# EAGLE design Main_Board (EAGLE 7.7.0)
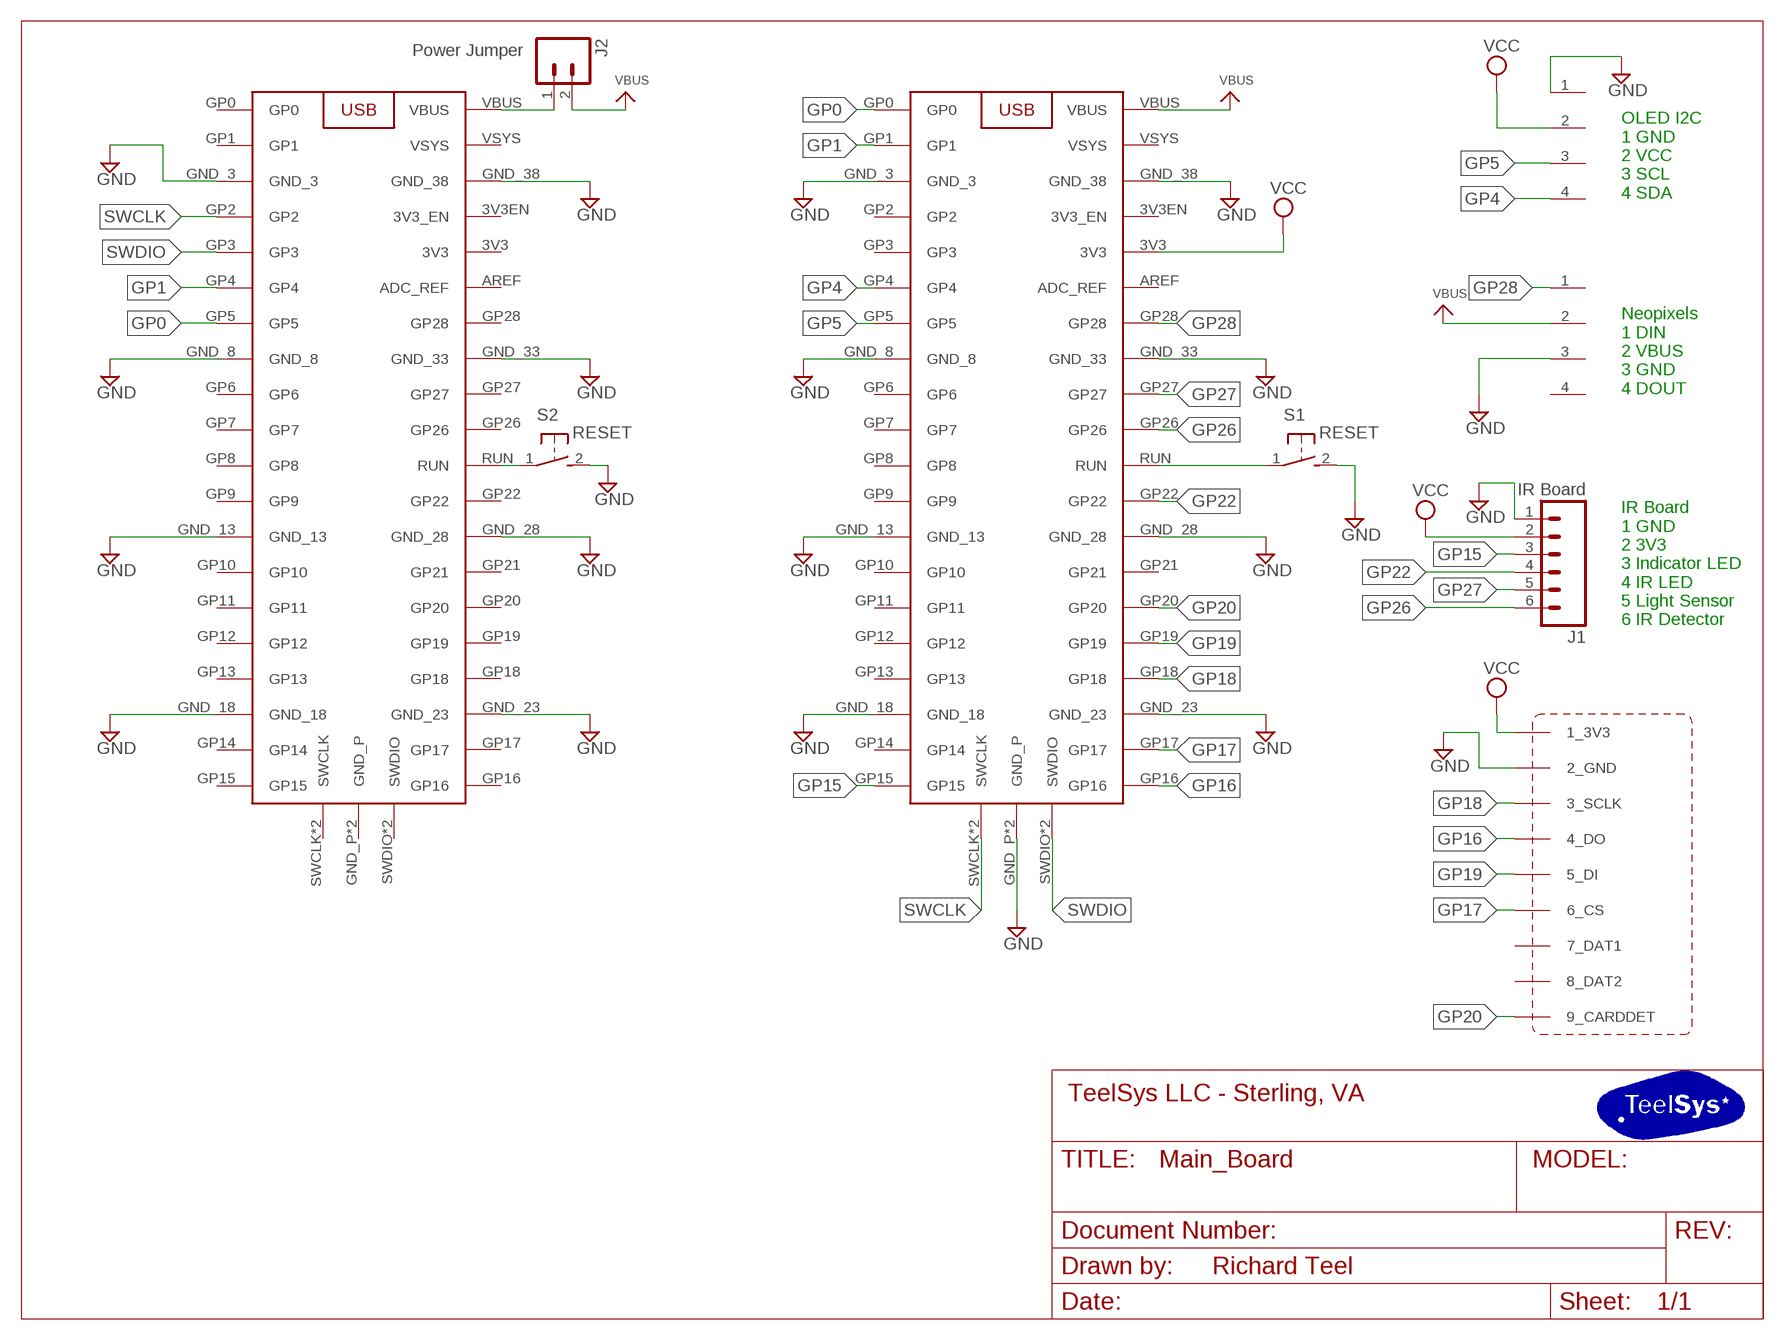
[diagram p0: schematic, sheet 1]
FRAME1 (LETTER_L): COMPANY_INFO: TeelSys LLC - Sterling, VA; DRAWN_BY: Richard Teel

## Parts
J1  IR Board  M06LONGPADS  [1X06_LONGPADS]
J2  Power Jumper  M02LOCK_LONGPADS  [1X02_LOCK_LONGPADS]
S1  RESET  ADAFRUIT_SW_1489THROUGH_HOLE  [ADAFRUIT_SW_1489]
S2  RESET  ADAFRUIT_SW_1489THROUGH_HOLE  [ADAFRUIT_SW_1489]
SDCARD2  ADAFRUIT_SDCARD3V3THROUGHHOLE  [ADAFRUIT_SDCARD3V3]
U$1  RASPBERRY_PI_PICORASPBERRY_PI_PICO_&_W  [RASPBERRY_PI_PICO_N_W]
U$2  RASPBERRY_PI_PICORASPBERRY_PI_PICO_&_W  [RASPBERRY_PI_PICO_N_W]
U$3  HEADER-1X4  [HEADER-1X4]
U$4  HEADER-1X4  [HEADER-1X4]

## Nets
GND: J1.1 S1.2(S) S2.2(S) SDCARD2.2_GND U$1.GND_3 U$1.GND_8 U$1.GND_13 U$1.GND_18 U$1.GND_23 U$1.GND_28 U$1.GND_33 U$1.GND_38 U$1.GND_P U$1.GND_P1(GND_P) U$2.GND_3 U$2.GND_8 U$2.GND_13 U$2.GND_18 U$2.GND_23 U$2.GND_28 U$2.GND_33 U$2.GND_38 U$3.3 U$4.1
GP0: U$1.GP0 U$2.GP5
GP1: U$1.GP1 U$2.GP4
GP4: U$1.GP4 U$4.4
GP5: U$1.GP5 U$4.3
GP15: J1.3 U$1.GP15
GP16: SDCARD2.4_DO U$1.GP16
GP17: SDCARD2.6_CS U$1.GP17
GP18: SDCARD2.3_SCLK U$1.GP18
GP19: SDCARD2.5_DI U$1.GP19
GP20: SDCARD2.9_CARDDET U$1.GP20
GP22: J1.4 U$1.GP22
GP26: J1.6 U$1.GP26
GP27: J1.5 U$1.GP27
GP28: U$1.GP28 U$3.1
N$1: S2.1(P) U$2.RUN
N$2: J2.1 U$2.VBUS
N$4: S1.1(P) U$1.RUN
SWCLK: U$1.SWCLK U$1.SWCLK1(SWCLK) U$2.GP2
SWDIO: U$1.SWDIO U$1.SWDIO1(SWDIO) U$2.GP3
VBUS: J2.2 U$1.VBUS U$3.2
VCC: J1.2 SDCARD2.1_3V3 U$1.3V3 U$4.2
Unconnected: SDCARD2.7_DAT1 SDCARD2.8_DAT2 U$1.3V3EN(3V3_EN) U$1.AREF(ADC_REF) U$1.GP2 U$1.GP3 U$1.GP6 U$1.GP7 U$1.GP8 U$1.GP9 U$1.GP10 U$1.GP11 U$1.GP12 U$1.GP13 U$1.GP14 U$1.GP21 U$1.VSYS U$2.3V3 U$2.3V3EN(3V3_EN) U$2.AREF(ADC_REF) U$2.GND_P U$2.GND_P1(GND_P) U$2.GP0 U$2.GP1 U$2.GP6 U$2.GP7 U$2.GP8 U$2.GP9 U$2.GP10 U$2.GP11 U$2.GP12 U$2.GP13 U$2.GP14 U$2.GP15 U$2.GP16 U$2.GP17 U$2.GP18 U$2.GP19 U$2.GP20 U$2.GP21 U$2.GP22 U$2.GP26 U$2.GP27 U$2.GP28 U$2.SWCLK U$2.SWCLK1(SWCLK) U$2.SWDIO U$2.SWDIO1(SWDIO) U$2.VSYS U$3.4

## Notes on the sheet
- OLED I2C
  1 GND
  2 VCC
  3 SCL
  4 SDA
- Neopixels
  1 DIN
  2 VBUS
  3 GND
  4 DOUT
- IR Board
  1 GND
  2 3V3
  3 Indicator LED
  4 IR LED
  5 Light Sensor
  6 IR Detector

## Library data of the parts
J1 = SparkFun-Connectors:M06: Header 6 Standard 6-pin 0.1" header. Use with straight break away headers (SKU : PRT-00116), right angle break away headers (PRT-00553), swiss pins (PRT-00743), machine pins (PRT-00117), and female headers (PRT-00115). Molex polarized connector foot print use with SKU : PRT-08094 with associated crimp pins and housings. NOTES ON THE VARIANTS LOCK and LOCK_LONGPADS... This footprint was designed to help hold the alignment of a through-hole component (i.e. 6-pin header) while soldering it into place. You may notice that each hole has been shifted either up or down by 0.005 of an inch from it's more standard position (which is a perfectly straight line). This slight alteration caused the pins (the squares in the middle) to touch the edges of the holes. Because they are alternating, it causes a "brace" to hold the component in place. 0.005 has proven to be the perfect amount of "off-center" position when using our standard breakaway headers. Although looks a little odd when you look at the bare footprint, once you have a header in there, the alteration is very hard to notice. Also,if you push a header all the way into place, it is covered up entirely on the bottom side. This idea of altering the position of holes to aid alignment will be further integrated into the Sparkfun Library for other footprints. It can help hold any component with 3 or more connection pins.
J2 = SparkFun-Connectors:M02: Standard 2-pin 0.1" header. Use with - straight break away headers ( PRT-00116) - right angle break away headers (PRT-00553) - swiss pins (PRT-00743) - machine pins (PRT-00117) - female headers (PRT-00115) Molex polarized connector foot print use with: PRT-08233 with associated crimp pins and housings. 2.54_SCREWTERM for use with PRT-10571. 3.5mm Screw Terminal footprints for PRT-08084 5mm Screw Terminal footprints for use with PRT-08432
S1 S2 = teelsys-0.2:ADAFRUIT_SW_1489: OMRON SWITCH
SDCARD2 = TeelSys-0.3:ADAFRUIT_SDCARD3V3: https://www.adafruit.com/product/4682; ADAFRUIT_PN: 4682
U$1 U$2 = teelsys-0.2:RASPBERRY_PI_PICO
U$3 U$4 = teelsys-0.2:HEADER-1X4

## Board
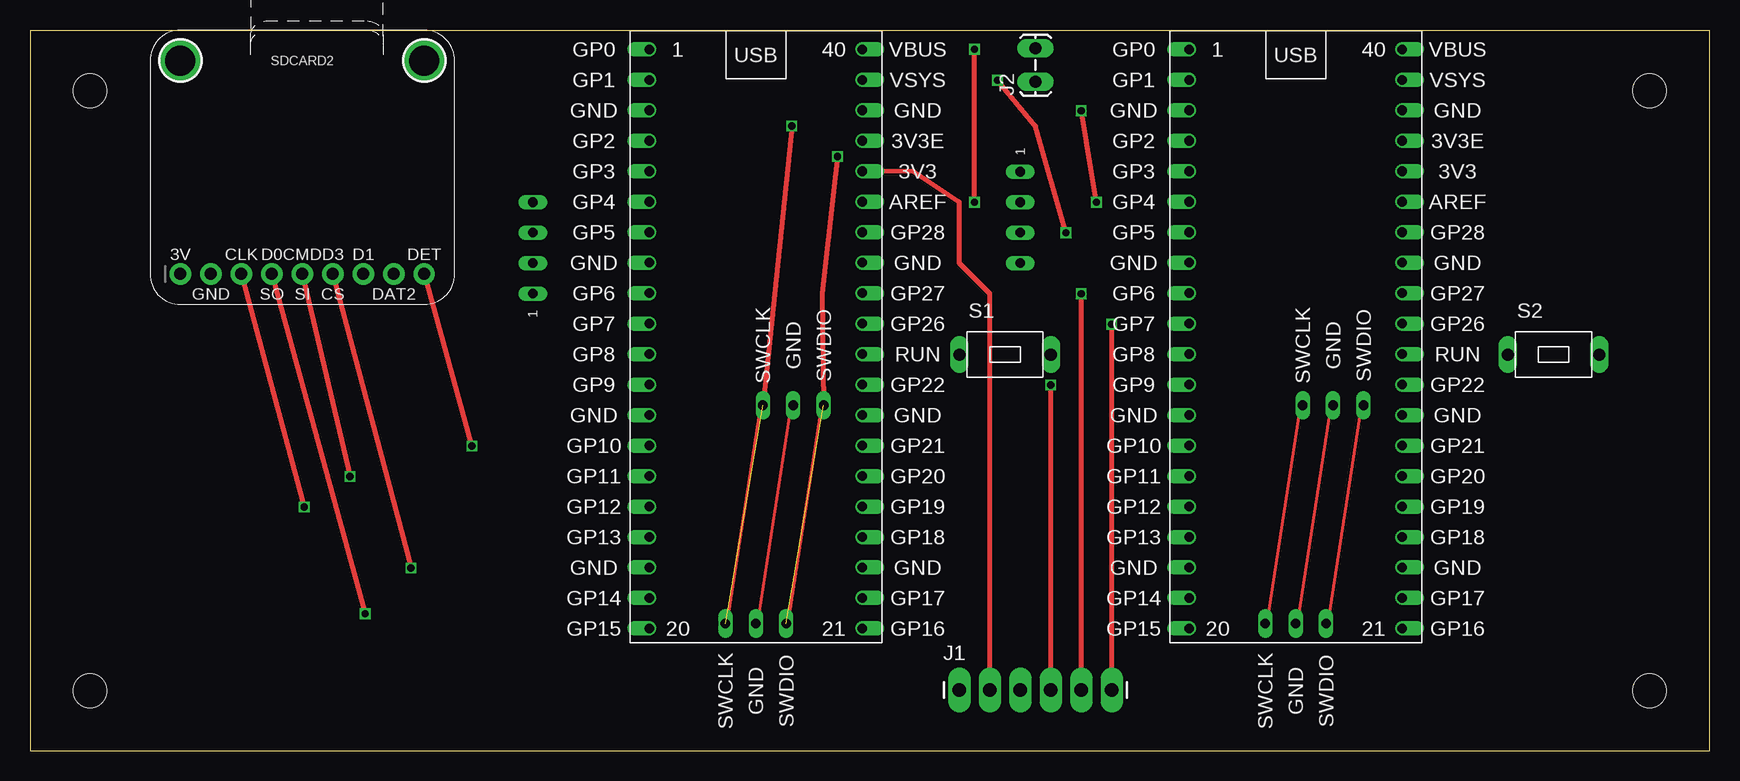
[diagram p1: board, top side]
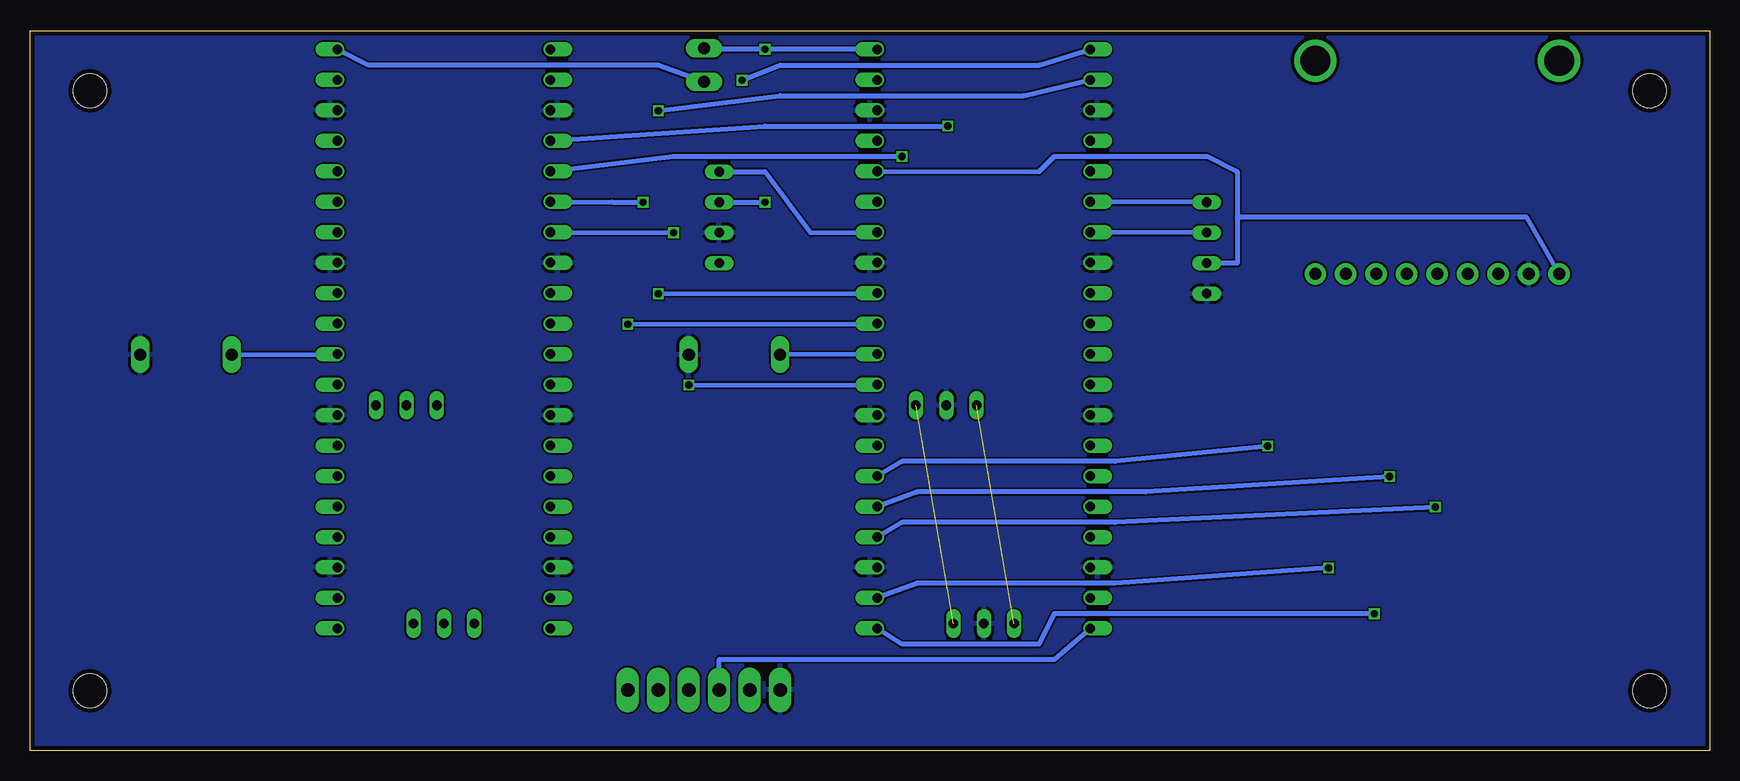
[diagram p2: board, bottom side, seen from below]

Size 140 x 60 mm. Coordinates in mm from the lower left corner, seen from the top.
Outline: 0,0 140,0 140,60 0,60 0,0
Copper layers (1*16): Top 0.035559375mm / dielectric 1.6mm / Bottom 0.035559375mm
Design rules "oshpark-2layer2020": minimum track width 6mil, minimum drill 10mil, track to track 6mil, track to pad 6mil, pad to pad 6mil, via to via 6mil, smd to smd 6mil, copper to edge 15mil, drill to drill 6mil, minimum pad ring 5mil, minimum via ring 5mil, stop-mask expansion 2.5mil, vias tented up to drill 0mil, thermal gap 10mil
Holes 2.8 mm at 5,5 5,55 135,5 135,55

### Footprints (pad centres in the part's own frame; a part is rotated, then mirrored left to right if it is on the bottom)
1X06_LONGPADS = drill 1.118 pad 1.88 long: 1 0,0; 2 2.54,0; 3 5.08,0; 4 7.62,0; 5 10.16,0; 6 12.7,0
1X02_LOCK_LONGPADS = drill 1.016 long: 1 -0.127,0; 2 2.667,0
ADAFRUIT_SW_1489 = drill 1.016 long: 1 -3.81,0; 2 3.81,0
ADAFRUIT_SDCARD3V3 = drill 1 pad 1.778: 1_3V3 2.54,2.54; 2_GND 5.08,2.54; 3_SCLK 7.62,2.54; 4_DO 10.16,2.54; 5_DI 12.7,2.54; 6_CS 15.24,2.54; 7_DAT1 17.78,2.54; 8_DAT2 20.32,2.54; 9_CARDDET 22.86,2.54 | drill 2.5 pad 3.2: P$1 22.86,20.32; P$2 2.54,20.32
RASPBERRY_PI_PICO_N_W = drill 0.8 offset: 3V3 19.39,39.3; 3V3EN 19.39,41.84; AREF 19.39,36.76; GND_3 1.61,44.38; GND_8 1.61,31.68; GND_13 1.61,18.98; GND_18 1.61,6.28; GND_23 19.39,6.28; GND_28 19.39,18.98; GND_33 19.39,31.68; GND_38 19.39,44.38; GP0 1.61,49.46; GP1 1.61,46.92; GP2 1.61,41.84; GP3 1.61,39.3; GP4 1.61,36.76; GP5 1.61,34.22; GP6 1.61,29.14; GP7 1.61,26.6; GP8 1.61,24.06; GP9 1.61,21.52; GP10 1.61,16.44; GP11 1.61,13.9; GP12 1.61,11.36; GP13 1.61,8.82; GP14 1.61,3.74; GP15 1.61,1.2; GP16 19.39,1.2; GP17 19.39,3.74; GP18 19.39,8.82; GP19 19.39,11.36; GP20 19.39,13.9; GP21 19.39,16.44; GP22 19.39,21.52; GP26 19.39,26.6; GP27 19.39,29.14; GP28 19.39,34.22; RUN 19.39,24.06; VBUS 19.39,49.46; VSYS 19.39,46.92 | drill 0.8 long: GND_P 13.624,19.8; GND_P1 10.5,1.6; SWCLK 11.084,19.8; SWCLK1 7.96,1.6; SWDIO 16.164,19.8; SWDIO1 13.04,1.6
HEADER-1X4 = drill 0.8 long: 1 0,3.81; 2 0,1.27; 3 0,-1.27; 4 0,-3.81

### Placement (x,y rotation side)
J1  77.47,5.08 0 top
J2  83.82,55.88 90 top
S1  81.28,33.02 0 top
S2  127,33.02 0 top
SDCARD2  10,37.2 0 top
U$1  50,9 0 top
U$2  95,9 0 top
U$3  82.55,44.45 0 top
U$4  41.91,41.91 180 top

### Tracks (layer width: path | path; a pad name or v marks a point on that pad's centre or on a via)
GND
  pour Bottom: 0,0 139.7,0 139.7,59.69 0,59.69
GP0  (via drill 0.6)
  Top 0.406: v86.36,43.18 83.82,52.07 v80.64,55.88
  Bottom 0.406: U$2.GP5 v86.36,43.18 | v80.64,55.88 77.47,57.15 55.88,57.15 U$1.GP0
GP1  (via drill 0.6)
  Top 0.406: v88.9,45.72 v87.63,53.34
  Bottom 0.406: U$2.GP4 91.44,45.72 v88.9,45.72 | v87.63,53.34 77.47,54.61 57.15,54.61 U$1.GP1
GP4
  Bottom 0.406: U$4.4 U$1.GP4
GP5
  Bottom 0.406: U$4.3 U$1.GP5
GP15
  Bottom 0.406: J1.3 82.55,7.62 54.61,7.62 U$1.GP15
GP16  (via drill 0.6)
  Top 0.406: SDCARD2.4_DO v27.94,11.43
  Bottom 0.406: v27.94,11.43 54.61,11.43 55.88,8.89 67.31,8.89 U$1.GP16
GP17  (via drill 0.6)
  Top 0.406: SDCARD2.6_CS v31.75,15.24
  Bottom 0.406: v31.75,15.24 49.53,13.97 66.04,13.97 U$1.GP17
GP18  (via drill 0.6)
  Top 0.406: SDCARD2.3_SCLK v22.86,20.32
  Bottom 0.406: v22.86,20.32 49.53,19.05 67.31,19.05 U$1.GP18
GP19  (via drill 0.6)
  Top 0.406: SDCARD2.5_DI v26.67,22.86
  Bottom 0.406: v26.67,22.86 46.99,21.59 66.04,21.59 U$1.GP19
GP20  (via drill 0.6)
  Top 0.406: SDCARD2.9_CARDDET v36.83,25.4
  Bottom 0.406: v36.83,25.4 49.53,24.13 67.31,24.13 U$1.GP20
GP22  (via drill 0.6)
  Top 0.406: J1.4 v85.09,30.48
  Bottom 0.406: v85.09,30.48 U$1.GP22
GP26  (via drill 0.6)
  Top 0.406: J1.6 v90.17,35.56
  Bottom 0.406: v90.17,35.56 U$1.GP26
GP27  (via drill 0.6)
  Top 0.406: J1.5 v87.63,38.1
  Bottom 0.406: v87.63,38.1 U$1.GP27
GP28
  Bottom 0.406: U$3.1 78.74,48.26 74.93,43.18 U$1.GP28
N$1
  Bottom 0.406: S2.1 U$2.RUN
N$2
  Bottom 0.406: J2.1 87.63,57.15 111.76,57.15 U$2.VBUS
N$4
  Bottom 0.406: U$1.RUN S1.1
SWCLK  (via drill 0.6)  (1 unrouted)
  Top 0.406: v63.5,52.07 U$1.SWCLK
  Bottom 0.406: U$2.GP2 78.74,52.07 v63.5,52.07
SWDIO  (via drill 0.6)  (1 unrouted)
  Top 0.406: v67.31,49.53 66.04,38.1 U$1.SWDIO
  Bottom 0.406: U$2.GP3 86.36,49.53 v67.31,49.53
VBUS  (via drill 0.6)
  Top 0.406: v78.74,45.72 v78.74,58.46
  Bottom 0.406: U$1.VBUS v78.74,58.46 83.82,58.46 J2.2 | U$3.2 v78.74,45.72
VCC
  Top 0.406: J1.2 80.01,38.1 77.47,40.64 77.47,45.72 73.66,48.26 U$1.3V3
  Bottom 0.406: U$1.3V3 55.88,48.26 54.61,49.53 41.91,49.53 39.37,48.26 39.37,44.45 | 39.37,44.45 39.37,40.64 U$4.2 | SDCARD2.1_3V3 15.24,44.45 39.37,44.45